# EAGLE design RobotArmController (EAGLE 7.3.0)
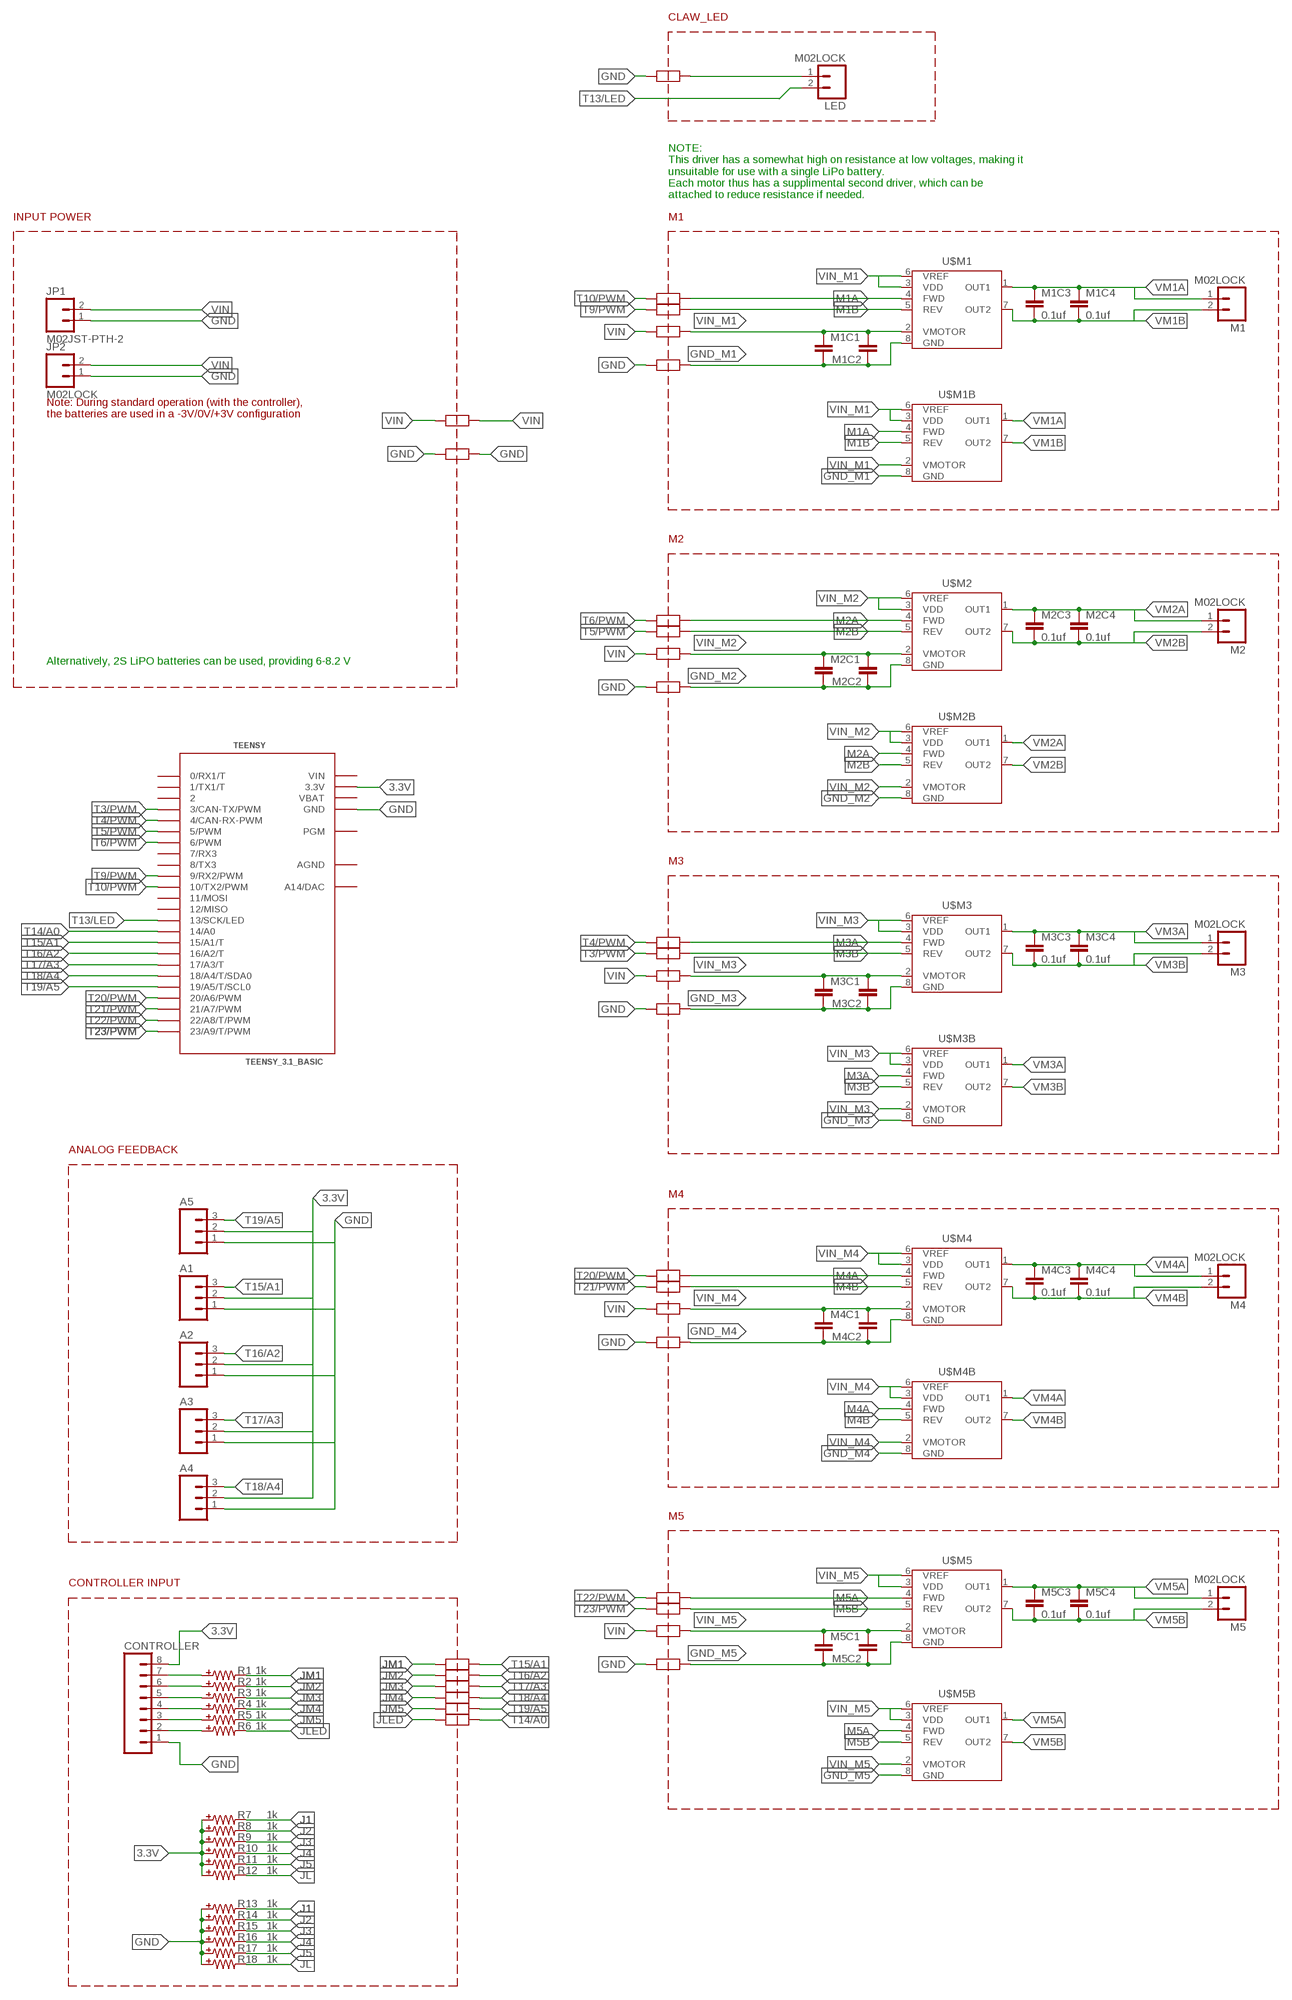
[diagram p0: schematic, sheet 1]

## Parts
A1  M03LOCK  [1X03_LOCK]
A2  M03LOCK  [1X03_LOCK]
A3  M03LOCK  [1X03_LOCK]
A4  M03LOCK  [1X03_LOCK]
A5  M03LOCK  [1X03_LOCK]
CONTROLLER  M08LOCK  [1X08_LOCK]
JP1  M02JST-PTH-2  [JST-2-PTH]
JP2  M02LOCK  [1X02_LOCK]
LED  M02LOCK  [1X02_LOCK]
M1  M02LOCK  [1X02_LOCK]
M1C1  CAP1210  [1210]
M1C2  CAPUNIVERSAL  [0402-0603-0805-UNIVERSAL]
M1C3  0.1uf  CAPUNIVERSAL  [0402-0603-0805-UNIVERSAL]
M1C4  0.1uf  CAPUNIVERSAL  [0402-0603-0805-UNIVERSAL]
M2  M02LOCK  [1X02_LOCK]
M2C1  CAP1210  [1210]
M2C2  CAPUNIVERSAL  [0402-0603-0805-UNIVERSAL]
M2C3  0.1uf  CAPUNIVERSAL  [0402-0603-0805-UNIVERSAL]
M2C4  0.1uf  CAPUNIVERSAL  [0402-0603-0805-UNIVERSAL]
M3  M02LOCK  [1X02_LOCK]
M3C1  CAP1210  [1210]
M3C2  CAPUNIVERSAL  [0402-0603-0805-UNIVERSAL]
M3C3  0.1uf  CAPUNIVERSAL  [0402-0603-0805-UNIVERSAL]
M3C4  0.1uf  CAPUNIVERSAL  [0402-0603-0805-UNIVERSAL]
M4  M02LOCK  [1X02_LOCK]
M4C1  CAP1210  [1210]
M4C2  CAPUNIVERSAL  [0402-0603-0805-UNIVERSAL]
M4C3  0.1uf  CAPUNIVERSAL  [0402-0603-0805-UNIVERSAL]
M4C4  0.1uf  CAPUNIVERSAL  [0402-0603-0805-UNIVERSAL]
M5  M02LOCK  [1X02_LOCK]
M5C1  CAP1210  [1210]
M5C2  CAPUNIVERSAL  [0402-0603-0805-UNIVERSAL]
M5C3  0.1uf  CAPUNIVERSAL  [0402-0603-0805-UNIVERSAL]
M5C4  0.1uf  CAPUNIVERSAL  [0402-0603-0805-UNIVERSAL]
R1  1k  RESISTORUNIVERSAL  [0402-0603-0805-UNIVERSAL]
R2  1k  RESISTORUNIVERSAL  [0402-0603-0805-UNIVERSAL]
R3  1k  RESISTORUNIVERSAL  [0402-0603-0805-UNIVERSAL]
R4  1k  RESISTORUNIVERSAL  [0402-0603-0805-UNIVERSAL]
R5  1k  RESISTORUNIVERSAL  [0402-0603-0805-UNIVERSAL]
R6  1k  RESISTORUNIVERSAL  [0402-0603-0805-UNIVERSAL]
R7  1k  RESISTORUNIVERSAL  [0402-0603-0805-UNIVERSAL]
R8  1k  RESISTORUNIVERSAL  [0402-0603-0805-UNIVERSAL]
R9  1k  RESISTORUNIVERSAL  [0402-0603-0805-UNIVERSAL]
R10  1k  RESISTORUNIVERSAL  [0402-0603-0805-UNIVERSAL]
R11  1k  RESISTORUNIVERSAL  [0402-0603-0805-UNIVERSAL]
R12  1k  RESISTORUNIVERSAL  [0402-0603-0805-UNIVERSAL]
R13  1k  RESISTORUNIVERSAL  [0402-0603-0805-UNIVERSAL]
R14  1k  RESISTORUNIVERSAL  [0402-0603-0805-UNIVERSAL]
R15  1k  RESISTORUNIVERSAL  [0402-0603-0805-UNIVERSAL]
R16  1k  RESISTORUNIVERSAL  [0402-0603-0805-UNIVERSAL]
R17  1k  RESISTORUNIVERSAL  [0402-0603-0805-UNIVERSAL]
R18  1k  RESISTORUNIVERSAL  [0402-0603-0805-UNIVERSAL]
TEENSY  TEENSY_3.1_BASIC  [TEENSY_3.1_BASIC]
U$1  NET-JUNCTION-2  [NET-JUNCTION-2]
U$2  NET-JUNCTION-2  [NET-JUNCTION-2]
U$3  NET-JUNCTION-2  [NET-JUNCTION-2]
U$4  NET-JUNCTION-2  [NET-JUNCTION-2]
U$5  NET-JUNCTION-2  [NET-JUNCTION-2]
U$6  NET-JUNCTION-2  [NET-JUNCTION-2]
U$7  NET-JUNCTION-2  [NET-JUNCTION-2]
U$8  NET-JUNCTION-2  [NET-JUNCTION-2]
U$9  NET-JUNCTION-2  [NET-JUNCTION-2]
U$10  NET-JUNCTION-2  [NET-JUNCTION-2]
U$11  NET-JUNCTION-2  [NET-JUNCTION-2]
U$12  NET-JUNCTION-2  [NET-JUNCTION-2]
U$13  NET-JUNCTION-2  [NET-JUNCTION-2]
U$14  NET-JUNCTION-2  [NET-JUNCTION-2]
U$15  NET-JUNCTION-2  [NET-JUNCTION-2]
U$16  NET-JUNCTION-2  [NET-JUNCTION-2]
U$17  NET-JUNCTION-2  [NET-JUNCTION-2]
U$18  NET-JUNCTION-2  [NET-JUNCTION-2]
U$19  NET-JUNCTION-2  [NET-JUNCTION-2]
U$20  NET-JUNCTION-2  [NET-JUNCTION-2]
U$21  NET-JUNCTION-2  [NET-JUNCTION-2]
U$22  NET-JUNCTION-2  [NET-JUNCTION-2]
U$23  NET-JUNCTION-2  [NET-JUNCTION-2]
U$24  NET-JUNCTION-2  [NET-JUNCTION-2]
U$25  NET-JUNCTION-2  [NET-JUNCTION-2]
U$26  NET-JUNCTION-2  [NET-JUNCTION-2]
U$27  NET-JUNCTION-2  [NET-JUNCTION-2]
U$28  NET-JUNCTION-2  [NET-JUNCTION-2]
U$29  NET-JUNCTION-2  [NET-JUNCTION-2]
U$M1  ZXBM5210  ZXBM5210SO8  [SO08]
U$M1B  ZXBM5210  ZXBM5210SO8  [SO08]
U$M2  ZXBM5210  ZXBM5210SO8  [SO08]
U$M2B  ZXBM5210  ZXBM5210SO8  [SO08]
U$M3  ZXBM5210  ZXBM5210SO8  [SO08]
U$M3B  ZXBM5210  ZXBM5210SO8  [SO08]
U$M4  ZXBM5210  ZXBM5210SO8  [SO08]
U$M4B  ZXBM5210  ZXBM5210SO8  [SO08]
U$M5  ZXBM5210  ZXBM5210SO8  [SO08]
U$M5B  ZXBM5210  ZXBM5210SO8  [SO08]

## Nets
3.3V: A1.2 A2.2 A3.2 A4.2 A5.2 CONTROLLER.8 R7.+ R8.+ R9.+ R10.+ R11.+ R12.+ TEENSY.3.3V TEENSY.3.3V1(3.3V)
GND [power]: A1.1 A2.1 A3.1 A4.1 A5.1 CONTROLLER.1 JP1.1 JP2.1 LED.1 R13.+ R14.+ R15.+ R16.+ R17.+ R18.+ TEENSY.GND TEENSY.GND1(GND) U$2.P$1 U$5.P$1 U$7.P$1 U$9.P$1 U$11.P$1 U$13.P$1 U$13.P$2 U$24.P$1 U$24.P$2
GND_M1 [power]: M1C1.2 M1C2.- U$2.P$2 U$M1.8(GND) U$M1B.8(GND)
GND_M2 [power]: M2C1.2 M2C2.- U$5.P$2 U$M2.8(GND) U$M2B.8(GND)
GND_M3 [power]: M3C1.2 M3C2.- U$7.P$2 U$M3.8(GND) U$M3B.8(GND)
GND_M4 [power]: M4C1.2 M4C2.- U$9.P$2 U$M4.8(GND) U$M4B.8(GND)
GND_M5 [power]: M5C1.2 M5C2.- U$11.P$2 U$M5.8(GND) U$M5B.8(GND)
J1: CONTROLLER.7 R1.+ R7.- R13.-
J2: CONTROLLER.6 R2.+ R8.- R14.-
J3: CONTROLLER.5 R3.+ R9.- R15.-
J4: CONTROLLER.4 R4.+ R10.- R16.-
J5: CONTROLLER.3 R5.+ R11.- R17.-
JL: CONTROLLER.2 R6.+ R12.- R18.-
JLED: R6.- U$29.P$1
JM1: R1.- U$12.P$1
JM2: R2.- U$25.P$1
JM3: R3.- U$26.P$1
JM4: R4.- U$27.P$1
JM5: R5.- U$28.P$1
M1A: U$14.P$2 U$M1.4(FWD) U$M1B.4(FWD)
M1B: U$15.P$2 U$M1.5(REV) U$M1B.5(REV)
M2A: U$16.P$2 U$M2.4(FWD) U$M2B.4(FWD)
M2B: U$17.P$2 U$M2.5(REV) U$M2B.5(REV)
M3A: U$18.P$2 U$M3.4(FWD) U$M3B.4(FWD)
M3B: U$19.P$2 U$M3.5(REV) U$M3B.5(REV)
M4A: U$20.P$2 U$M4.4(FWD) U$M4B.4(FWD)
M4B: U$21.P$2 U$M4.5(REV) U$M4B.5(REV)
M5A: U$22.P$2 U$M5.4(FWD) U$M5B.4(FWD)
M5B: U$23.P$2 U$M5.5(REV) U$M5B.5(REV)
T3/PWM [power]: TEENSY.3(3/CAN-TX/PWM) U$19.P$1
T4/PWM [power]: TEENSY.4(4/CAN-RX-PWM) U$18.P$1
T5/PWM [power]: TEENSY.5(5/PWM) U$17.P$1
T6/PWM [power]: TEENSY.6(6/PWM) U$16.P$1
T9/PWM [power]: TEENSY.9(9/RX2/PWM) U$15.P$1
T10/PWM [power]: TEENSY.10(10/TX2/PWM) U$14.P$1
T13/LED [power]: LED.2 TEENSY.13(13/SCK/LED)
T14/A0 [power]: TEENSY.14/A0 U$29.P$2
T15/A1 [power]: A1.3 TEENSY.15/A1(15/A1/T) U$12.P$2
T16/A2 [power]: A2.3 TEENSY.16/A2(16/A2/T) U$25.P$2
T17/A3 [power]: A3.3 TEENSY.17/A3(17/A3/T) U$26.P$2
T18/A4 [power]: A4.3 TEENSY.18/A4(18/A4/T/SDA0) U$27.P$2
T19/A5 [power]: A5.3 TEENSY.19/A5(19/A5/T/SCL0) U$28.P$2
T20/PWM [power]: TEENSY.20/A6(20/A6/PWM) U$20.P$1
T21/PWM [power]: TEENSY.21/A7(21/A7/PWM) U$21.P$1
T22/PWM [power]: TEENSY.22/A8(22/A8/T/PWM) U$22.P$1
T23/PWM [power]: TEENSY.23/A9(23/A9/T/PWM) U$23.P$1
VIN [power]: JP1.2 JP2.2 U$1.P$1 U$3.P$1 U$4.P$1 U$4.P$2 U$6.P$1 U$8.P$1 U$10.P$1
VIN_M1 [power]: M1C1.1 M1C2.+ U$1.P$2 U$M1.2(VMOTOR) U$M1.3(VDD) U$M1.6(VREF) U$M1B.2(VMOTOR) U$M1B.3(VDD) U$M1B.6(VREF)
VIN_M2 [power]: M2C1.1 M2C2.+ U$3.P$2 U$M2.2(VMOTOR) U$M2.3(VDD) U$M2.6(VREF) U$M2B.2(VMOTOR) U$M2B.3(VDD) U$M2B.6(VREF)
VIN_M3 [power]: M3C1.1 M3C2.+ U$6.P$2 U$M3.2(VMOTOR) U$M3.3(VDD) U$M3.6(VREF) U$M3B.2(VMOTOR) U$M3B.3(VDD) U$M3B.6(VREF)
VIN_M4 [power]: M4C1.1 M4C2.+ U$8.P$2 U$M4.2(VMOTOR) U$M4.3(VDD) U$M4.6(VREF) U$M4B.2(VMOTOR) U$M4B.3(VDD) U$M4B.6(VREF)
VIN_M5 [power]: M5C1.1 M5C2.+ U$10.P$2 U$M5.2(VMOTOR) U$M5.3(VDD) U$M5.6(VREF) U$M5B.2(VMOTOR) U$M5B.3(VDD) U$M5B.6(VREF)
VM1A [power]: M1.1 M1C3.- M1C4.- U$M1.1(OUT1) U$M1B.1(OUT1)
VM1B [power]: M1.2 M1C3.+ M1C4.+ U$M1.7(OUT2) U$M1B.7(OUT2)
VM2A [power]: M2.1 M2C3.- M2C4.- U$M2.1(OUT1) U$M2B.1(OUT1)
VM2B [power]: M2.2 M2C3.+ M2C4.+ U$M2.7(OUT2) U$M2B.7(OUT2)
VM3A [power]: M3.1 M3C3.- M3C4.- U$M3.1(OUT1) U$M3B.1(OUT1)
VM3B [power]: M3.2 M3C3.+ M3C4.+ U$M3.7(OUT2) U$M3B.7(OUT2)
VM4A [power]: M4.1 M4C3.- M4C4.- U$M4.1(OUT1) U$M4B.1(OUT1)
VM4B [power]: M4.2 M4C3.+ M4C4.+ U$M4.7(OUT2) U$M4B.7(OUT2)
VM5A [power]: M5.1 M5C3.- M5C4.- U$M5.1(OUT1) U$M5B.1(OUT1)
VM5B [power]: M5.2 M5C3.+ M5C4.+ U$M5.7(OUT2) U$M5B.7(OUT2)
Unconnected: TEENSY.0(0/RX1/T) TEENSY.1(1/TX1/T) TEENSY.2 TEENSY.7(7/RX3) TEENSY.8(8/TX3) TEENSY.11(11/MOSI) TEENSY.12(12/MISO) TEENSY.A14(A14/DAC) TEENSY.PGM

## Notes on the sheet
- CLAW_LED
- NOTE:
  This driver has a somewhat high on resistance at low voltages, making it 
  unsuitable for use with a single LiPo battery. 
  Each motor thus has a supplimental second driver, which can be 
  attached to reduce resistance if needed.
- INPUT POWER | M1
- Note: During standard operation (with the controller),
  the batteries are used in a -3V/0V/+3V configuration
- M2
- Alternatively, 2S LiPO batteries can be used, providing 6-8.2 V
- M3
- ANALOG FEEDBACK
- M4
- M5
- CONTROLLER INPUT

## Power pins joined to a net without a drawn wire
AGND: TEENSY.AGND
VBAT: TEENSY.VBAT
VIN: TEENSY.VIN

## Library data of the parts
A1-A5 = tekdemo:M03: Header 3 Standard 3-pin 0.1" header. Use with straight break away headers (SKU : PRT-00116), right angle break away headers (PRT-00553), swiss pins (PRT-00743), machine pins (PRT-00117), and female headers (PRT-00115). Molex polarized connector foot print use with SKU : PRT-08232 with associated crimp pins and housings.
CONTROLLER = SparkFun-Connectors:M08: Header 8 Standard 8-pin 0.1" header. Use with straight break away headers (SKU : PRT-00116), right angle break away headers (PRT-00553), swiss pins (PRT-00743), machine pins (PRT-00117), and female headers (PRT-00115).
JP1 = tekdemo:M02: Standard 2-pin 0.1" header. Use with - straight break away headers ( PRT-00116) - right angle break away headers (PRT-00553) - swiss pins (PRT-00743) - machine pins (PRT-00117) - female headers (PRT-00115) Molex polarized connector foot print use with: PRT-08233 with associated crimp pins and housings. 2.54_SCREWTERM for use with PRT-10571. 3.5mm Screw Terminal footprints for PRT-08084 5mm Screw Terminal footprints for use with PRT-08432; SKU: PRT-09914
JP2 LED M1-M5 = tekdemo:M02: Standard 2-pin 0.1" header. Use with - straight break away headers ( PRT-00116) - right angle break away headers (PRT-00553) - swiss pins (PRT-00743) - machine pins (PRT-00117) - female headers (PRT-00115) Molex polarized connector foot print use with: PRT-08233 with associated crimp pins and housings. 2.54_SCREWTERM for use with PRT-10571. 3.5mm Screw Terminal footprints for PRT-08084 5mm Screw Terminal footprints for use with PRT-08432
M1C1-M1C4 M2C1-M2C4 M3C1-M3C4 M4C1-M4C4 M5C1-M5C4 = tekdemo:CAP: Capacitor Standard 0603 ceramic capacitor, and 0.1" leaded capacitor.
R1-R18 = tekdemo:RESISTOR: Resistor Basic schematic elements and footprints for 0603, 1206, and PTH resistors.
TEENSY = Teensy_3_Series_Board_v1.0:TEENSY_3.1_BASIC: Footprint for Teensy 3.1 board using all pin connections on the outer perimeter
U$1-U$29 = tekdemo:NET-JUNCTION-2
U$M1 U$M1B U$M2 U$M2B U$M3 U$M3B U$M4 U$M4B U$M5 U$M5B = tekdemo:ZXBM5210: PWM Motor Driver http://www.diodes.com/datasheets/ZXBM5210.pdf

## Net classes
1 power: width 0.508 mm, drill 0.508 mm, clearance 0.254 mm to class 0, clearance 0.254 mm

## Board
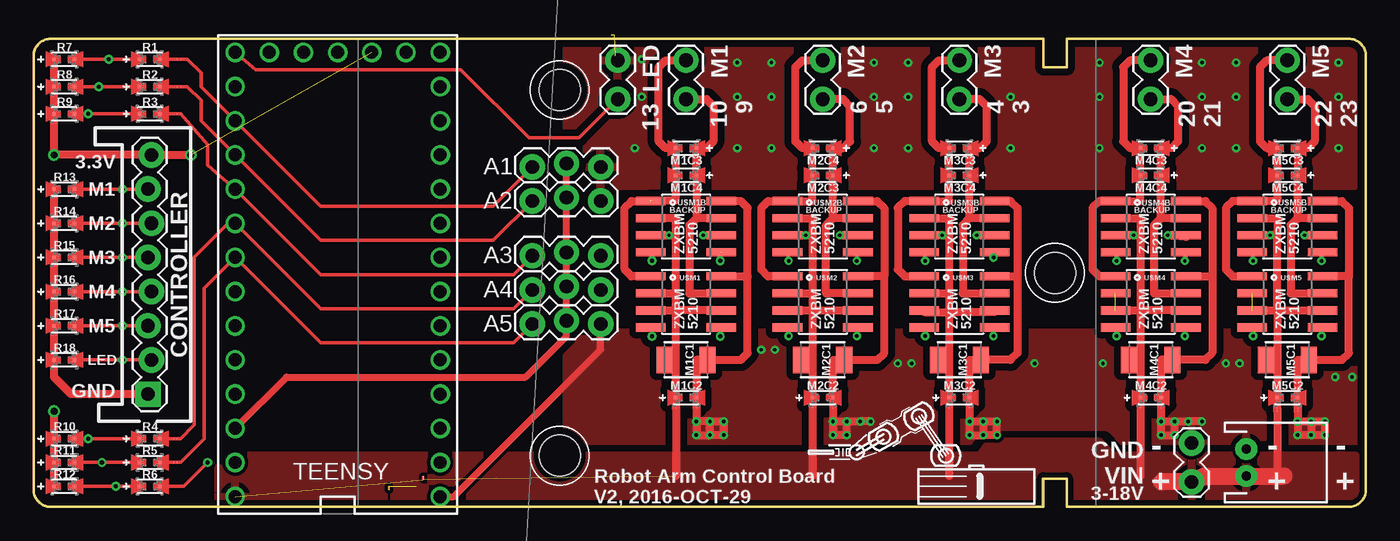
[diagram p1: board, top side]
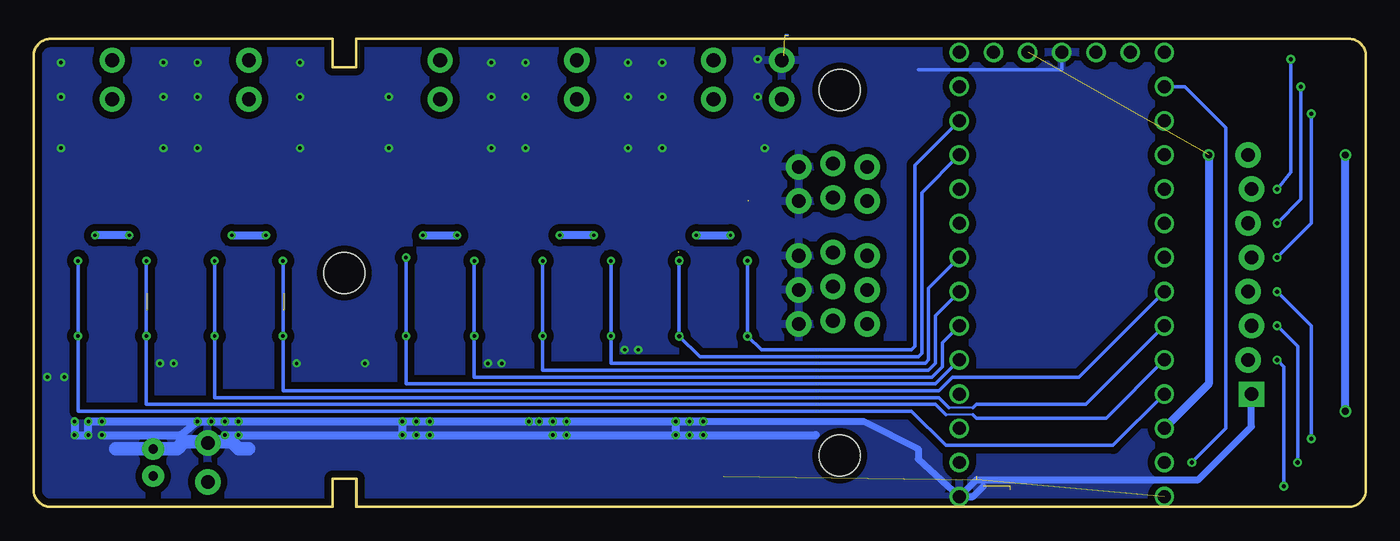
[diagram p2: board, bottom side, seen from below]

Size 99.06 x 34.8 mm. Coordinates in mm from the lower left corner, seen from the top.
Outline: 75.06,0 75.06,2.11
Outline: 75.08,0 1.27,0 arc-90 0,1.27 0,33.53 arc-90 1.27,34.8 75.08,34.8 75.08,32.69 76.81,32.69 76.81,34.8 97.79,34.8 arc-90 99.06,33.53 99.06,1.27 arc-90 97.79,0 76.81,0 76.81,2.11 75.08,2.11 75.08,0
Copper layers (1*16): Top 0.0356mm / dielectric 1.5011mm / Bottom 0.0356mm
Design rules "LaenPCBOrder-tented *": minimum track width 6mil, minimum drill 10mil, track to track 6mil, track to pad 6mil, pad to pad 6mil, via to via 6mil, smd to smd 0mil, copper to edge 15mil, drill to drill 6mil, minimum pad ring 7mil, minimum via ring 7mil, stop-mask expansion 4mil, vias tented up to drill 25mil, thermal gap 15mil
Holes 3.05 mm at 75.95,17.4 39.12,30.99 39.12,3.81

### Footprints (pad centres in the part's own frame; a part is rotated, then mirrored left to right if it is on the bottom)
1X03_LOCK = drill 1.016 pad 1.88: 1 0,0.127; 2 2.54,-0.127; 3 5.08,0.127
1X08_LOCK = drill 1.016 pad 1.88 square: 1 0,0.127 | drill 1.016 pad 1.88: 2 2.54,-0.127; 3 5.08,0.127; 4 7.62,-0.127; 5 10.16,0.127; 6 12.7,-0.127; 7 15.24,0.127; 8 17.78,-0.127
JST-2-PTH = drill 0.7 pad 1.6: 1 -1,0; 2 1,0
1X02_LOCK = drill 1.016 pad 1.88: 1 -0.178,0; 2 2.718,0
1210 = smd 1.2 x 2: 1 -1.6,0; 2 1.6,0
0402-0603-0805-UNIVERSAL = smd 0.254 x 0.254: + -0.762,0; - 0.762,0
TEENSY_3.1_BASIC = drill 0.965: 0 -7.62,13.97; 1 -7.62,11.43; 2 -7.62,8.89; 3 -7.62,6.35; 3.3V 7.62,11.43; 3.3V1 -2.54,-16.51; 4 -7.62,3.81; 5 -7.62,1.27; 6 -7.62,-1.27; 7 -7.62,-3.81; 8 -7.62,-6.35; 9 -7.62,-8.89; 10 -7.62,-11.43; 11 -7.62,-13.97; 12 -7.62,-16.51; 13 7.62,-16.51; 14/A0 7.62,-13.97; 15/A1 7.62,-11.43; 16/A2 7.62,-8.89; 17/A3 7.62,-6.35; 18/A4 7.62,-3.81; 19/A5 7.62,-1.27; 20/A6 7.62,1.27; 21/A7 7.62,3.81; 22/A8 7.62,6.35; 23/A9 7.62,8.89; A14 5.08,-16.51; AGND 7.62,13.97; GND -7.62,16.51; GND1 0,-16.51; PGM 2.54,-16.51; VBAT -5.08,-16.51; VIN 7.62,16.51
NET-JUNCTION-2 = smd 0.127 x 0.127: P$1 0,0; P$2 0.254,0
SO08 = smd 0.61 x 2.21: 1 -1.905,-2.616; 2 -0.635,-2.616; 3 0.635,-2.616; 4 1.905,-2.616; 5 1.905,2.616; 6 0.635,2.616; 7 -0.635,2.616; 8 -1.905,2.616

### Placement (x,y rotation side)
A1  42.16,25.4 180 top
A2  42.16,22.86 180 top
A3  42.16,18.8 180 top
A4  42.16,16.26 180 top
A5  42.16,13.72 180 top
CONTROLLER  8.64,8.38 90 top
JP1  90.17,3.3 270 top
JP2  86.11,4.57 270 top
LED  43.43,33.02 270 top
M1  48.51,33.02 270 top
M1C1  48.51,10.92 0 top
M1C2  48.51,8.13 0 top
M1C3  48.51,26.67 180 top
M1C4  48.51,24.64 180 top
M2  58.67,33.02 270 top
M2C1  58.67,10.92 0 top
M2C2  58.67,8.13 0 top
M2C3  58.67,24.64 180 top
M2C4  58.67,26.67 180 top
M3  68.83,33.02 270 top
M3C1  68.83,10.92 0 top
M3C2  68.83,8.13 0 top
M3C3  68.83,26.67 180 top
M3C4  68.83,24.64 180 top
M4  83.06,33.02 270 top
M4C1  83.06,10.92 0 top
M4C2  83.06,8.13 0 top
M4C3  83.06,26.67 180 top
M4C4  83.06,24.64 180 top
M5  93.22,33.02 270 top
M5C1  93.22,10.92 0 top
M5C2  93.22,8.13 0 top
M5C3  93.22,26.67 180 top
M5C4  93.22,24.64 180 top
R1  8.64,33.27 0 top
R2  8.64,31.24 0 top
R3  8.64,29.21 0 top
R4  8.64,5.08 0 top
R5  8.64,3.3 0 top
R6  8.64,1.52 0 top
R7  2.29,33.27 0 top
R8  2.29,31.24 0 top
R9  2.29,29.21 0 top
R10  2.29,5.08 0 top
R11  2.29,3.3 0 top
R12  2.29,1.52 0 top
R13  2.29,23.62 0 top
R14  2.29,21.08 0 top
R15  2.29,18.54 0 top
R16  2.29,16 0 top
R17  2.29,13.46 0 top
R18  2.29,10.92 0 top
TEENSY  22.61,17.27 180 top
U$1  47.75,7.62 270 top
U$2  49.28,7.62 270 top
U$3  57.91,7.62 270 top
U$4  28.96,2.29 270 top
U$5  59.44,7.62 270 top
U$6  68.07,7.62 270 top
U$7  69.6,7.62 270 top
U$8  82.3,7.62 270 top
U$9  83.82,7.62 270 top
U$10  92.46,7.37 270 top
U$11  93.98,7.37 270 top
U$12  10.92,33.27 180 top
U$13  42.93,35.05 180 bottom
U$14  40.89,11.68 0 bottom
U$15  40.89,11.18 0 bottom
U$16  40.89,10.67 0 bottom
U$17  40.89,10.16 0 bottom
U$18  40.89,9.65 0 bottom
U$19  40.89,9.14 0 bottom
U$20  40.89,8.64 0 bottom
U$21  40.89,8.13 0 bottom
U$22  40.89,7.62 0 bottom
U$23  40.89,7.11 0 bottom
U$24  26.42,1.52 270 top
U$25  10.92,31.24 180 top
U$26  10.92,29.21 180 top
U$27  10.67,5.08 180 top
U$28  10.67,3.3 180 top
U$29  14.22,31.24 0 bottom
U$M1  48.51,15.24 270 top
U$M1B  48.51,20.83 270 top
U$M2  58.67,15.24 270 top
U$M2B  58.67,20.83 270 top
U$M3  68.83,15.24 270 top
U$M3B  68.83,20.83 270 top
U$M4  83.06,15.24 270 top
U$M4B  83.06,20.83 270 top
U$M5  93.22,15.24 270 top
U$M5B  93.22,20.83 270 top

### Tracks (layer width: path | path; a pad name or v marks a point on that pad's centre or on a via)
3.3V  (via drill 0.51)  (1 unrouted)
  Top 0.508: A1.2 A2.2 A3.2 A4.2 A5.2 39.62,12.7 36.58,9.65 18.8,9.65 TEENSY.3.3V
  Top 0.61: v11.68,26.16 CONTROLLER.8 v1.52,26.16 R9.+ R8.+ R7.+ | R12.+ R11.+ R10.+ v1.52,7.11
  Bottom 0.61: v11.68,26.16 11.68,9.14 TEENSY.3.3V | v1.52,7.11 v1.52,26.16
GND  (via drill 0.25)  (4 unrouted)
  Top 0.508: TEENSY.GND 31.24,0.76 42.16,11.68 42.16,13.72
  Top 0.61: U$11.P$1 v93.98,6.35 | U$9.P$1 v83.82,6.35 | U$7.P$1 v69.6,6.35 | U$5.P$1 v59.44,6.35 | U$2.P$1 v49.28,6.35 | v93.98,6.35 v93.98,5.33 v95,5.33 | 83.82,8.13 v83.82,6.35 | v83.82,6.35 v83.82,5.33 v84.84,5.33 v84.84,6.35 | 69.6,8.13 v69.6,6.35 | v69.6,6.35 v69.6,5.33 v70.61,5.33 | 59.44,8.13 v59.44,6.35 | v59.44,6.35 v59.44,5.33 v60.45,5.33 v60.45,6.35 | 49.28,8.13 v49.28,6.35 | v49.28,6.35 v49.28,5.33 v50.29,5.33 | 93.98,7.87 v93.98,6.35 | v50.29,5.33 v51.31,5.33 v51.31,6.35 v50.29,6.35 | v50.29,5.33 v50.29,6.35 | v50.29,6.35 v49.28,6.35 | v59.44,6.35 v60.45,6.35 | v62.23,6.35 v61.47,6.35 v60.45,6.35 | v69.6,6.35 v70.61,6.35 | v70.61,6.35 v70.61,5.33 | v83.82,6.35 v84.84,6.35 | v86.87,6.35 v85.85,6.35 v84.84,6.35 | v95,5.33 v96.01,5.33 v96.01,6.35 v95,6.35 | v93.98,6.35 v95,6.35 | v95,6.35 v95,5.33 | v70.61,6.35 v71.63,6.35 v71.63,5.33 v70.61,5.33 | CONTROLLER.1 2.79,8.38 1.52,9.65 R18.+ R17.+ R16.+ R15.+ R14.+ R13.+
  Bottom 0.254: LED.1 43.26,33.53 | TEENSY.GND1 22.61,32.51 33.27,32.51
  Bottom 0.508: v49.28,6.35 37.34,6.35 33.27,4.32 33.27,3.56 TEENSY.GND | TEENSY.GND 29.21,0.76 28.45,1.52 | TEENSY.GND 28.96,2.03 12.45,2.03 8.51,5.97 CONTROLLER.1
  Bottom 0.61: v71.63,5.33 v71.63,6.35 | v62.23,6.35 v61.47,6.35 | v51.31,5.33 v51.31,6.35 | v93.98,5.33 88.14,5.33 v86.87,6.35 | v84.84,5.33 v83.82,5.33 v70.61,5.33 v69.6,5.33 v60.45,5.33 v59.44,5.33 v50.29,5.33 v49.28,5.33 40.89,5.33 | v86.87,6.35 v93.98,6.35 v95,6.35 v95,5.33 v96.01,5.33 v96.01,6.35 | v86.87,6.35 v85.85,6.35 v84.84,6.35 v83.82,6.35 v70.61,6.35 v69.6,6.35 v60.45,6.35 v59.44,6.35 v50.29,6.35 v49.28,6.35
  Bottom 1.016: 92.96,4.32 88.39,4.32 87.88,4.83 84.33,4.83 83.82,4.32 83.06,4.32
  other vias: 98.04,9.65 96.77,9.65 89.66,10.67 88.65,10.67 79.5,10.67 74.42,10.67 64.26,10.67 65.28,10.67 55.12,11.68 54.1,11.68 45.21,33.27 45.21,30.48 44.7,26.67 52.32,33.02 52.32,30.48 52.32,26.67 54.86,26.67 54.86,30.48 54.86,33.02 62.48,33.02 62.48,30.48 62.48,26.67 65.02,26.67 65.02,30.48 65.02,33.02 72.64,30.48 72.64,26.67 79.25,26.67 79.25,30.48 79.25,33.02 86.87,33.02 86.87,30.48 86.87,26.67 89.41,26.67 89.41,30.48 89.41,33.02 97.03,33.02 97.03,30.48 97.03,26.67
  pour Bottom (isolate 0.508): 14.22,0.25 14.22,34.54 98.3,35.05 98.3,0.76
  pour Top (isolate 0.508, rank 6): 39.62,12.95 39.62,4.32 98.3,4.32 98.3,12.95
  pour Top (isolate 0.508, rank 6): 39.62,34.8 39.62,23.88 98.3,23.88 98.3,34.8
GND_M1
  Top 0.61: 53.09,17.15 53.09,11.43 52.58,10.92 M1C1.2 49.28,10.92 M1C2.- U$2.P$2 | 53.09,17.15 53.09,22.23 52.58,22.73 U$M1B.8 | U$M1.8 53.09,17.15
GND_M2
  Top 0.508: M2C2.- U$5.P$2
  Top 0.61: M2C2.- 59.44,10.92 M2C1.2 62.74,10.92 63.25,11.43 63.25,17.15 | 63.25,17.15 U$M2.8 | U$M2B.8 62.74,22.73 63.25,22.23 63.25,17.15
GND_M3
  Top 0.61: U$M3B.8 72.64,22.73 73.15,22.23 73.15,17.15 | U$M3.8 73.15,17.15 | 73.15,17.15 73.15,11.43 72.64,10.92 M3C1.2 69.6,10.92 M3C2.- U$7.P$2
GND_M4
  Top 0.61: U$M4B.8 87.12,22.73 87.63,22.23 87.63,17.15 | U$M4.8 87.63,17.15 | 87.63,17.15 87.63,11.43 87.12,10.92 M4C1.2 83.82,10.92 M4C2.- U$9.P$2
GND_M5
  Top 0.61: U$M5B.8 97.28,22.73 97.79,22.23 97.79,17.15 | 97.79,17.15 U$M5.8 | 97.79,17.15 97.79,11.43 97.28,10.92 M5C1.2 93.98,10.92 M5C2.- U$11.P$2
J1  (via drill 0.3)
  Top 0.254: R1.+ v5.59,33.27 R7.- | CONTROLLER.7 v6.6,23.62 R13.-
  Bottom 0.254: v5.59,33.27 5.59,24.89 v6.6,23.62
J2  (via drill 0.3)
  Top 0.254: R2.+ v4.83,31.24 R8.- | CONTROLLER.6 v6.6,21.08 R14.-
  Bottom 0.254: v4.83,31.24 4.83,22.86 v6.6,21.08
J3  (via drill 0.3)
  Top 0.254: R3.+ v4.06,29.21 R9.- | CONTROLLER.5 v6.6,18.54 R15.-
  Bottom 0.254: v4.06,29.21 4.06,21.08 v6.6,18.54
J4  (via drill 0.3)
  Top 0.254: CONTROLLER.4 v6.6,16 R16.- | R4.+ v4.06,5.08 R10.-
  Bottom 0.254: v6.6,16 4.06,13.46 v4.06,5.08
J5  (via drill 0.3)
  Top 0.254: CONTROLLER.3 v6.6,13.46 R17.- | R5.+ v5.08,3.3 R11.-
  Bottom 0.254: v6.6,13.46 5.08,11.94 v5.08,3.3
JL  (via drill 0.3)
  Top 0.254: CONTROLLER.2 v6.6,10.92 R18.- | R6.+ v6.1,1.52 R12.-
  Bottom 0.254: v6.6,10.92 6.1,10.41 v6.1,1.52
JLED  (via drill 0.3)
  Top 0.254: v12.95,3.3 11.18,1.52 R6.-
  Bottom 0.254: U$29.P$1 13.46,31.24 10.41,28.19 10.41,5.84 v12.95,3.3
JM1
  Top 0.254: U$12.P$1 R1.-
JM2
  Top 0.254: R2.- U$25.P$1
JM3
  Top 0.254: R3.- U$26.P$1
JM4
  Top 0.254: R4.- U$27.P$1
JM5
  Top 0.254: R5.- U$28.P$1
M1A  (via drill 0.3)
  Top 0.254: U$M1B.4 45.97,18.92 v45.97,18.29 | U$M1.4 v45.97,12.7
  Bottom 0.254: v45.97,18.29 v45.97,12.7 44.96,11.68 U$14.P$2
M1B  (via drill 0.3)  (1 unrouted)
  Top 0.254: 51.05,18.92 v51.05,18.29 | U$M1.5 v51.05,12.7
  Bottom 0.254: v51.05,18.29 v51.05,12.7 49.53,11.18 U$15.P$2
M2A  (via drill 0.25)
  Top 0.254: U$M2B.4 56.13,18.92 v56.13,18.29 | U$M2.4 56.13,13.33 v56.13,12.7
  Bottom 0.254: v56.13,18.29 v56.13,12.7 56.13,10.67 U$16.P$2
M2B  (via drill 0.25)
  Top 0.254: U$M2B.5 61.21,18.92 v61.21,18.29 | v61.21,12.7 61.29,12.7 U$M2.5
  Bottom 0.254: v61.21,18.29 v61.21,12.7 61.21,10.16 U$17.P$2
M3A  (via drill 0.25)
  Top 0.254: U$M3B.4 66.22,18.29 v66.29,18.29 | v66.29,12.7 66.29,13.33 U$M3.4
  Bottom 0.254: v66.29,18.29 v66.29,12.7 66.29,9.65 U$18.P$2
M3B  (via drill 0.25)
  Top 0.254: U$M3B.5 71.45,18.54 v71.37,18.54 | v71.37,12.7 71.37,13.33 U$M3.5
  Bottom 0.254: v71.37,18.54 v71.37,12.7 71.37,9.14 U$19.P$2
M4A  (via drill 0.25)
  Top 0.254: U$M4B.4 80.52,18.92 v80.52,18.29 | v80.52,12.7 80.52,13.33 U$M4.4
  Bottom 0.254: v80.52,18.29 v80.52,12.7 80.52,8.64 U$20.P$2
M4B  (via drill 0.25)
  Top 0.254: U$M4B.5 85.67,18.29 v85.6,18.29 | v85.6,12.7 85.6,13.33 U$M4.5
  Bottom 0.254: v85.6,18.29 v85.6,12.7 85.6,8.13 U$21.P$2
M5A  (via drill 0.25)
  Top 0.254: U$M5B.4 90.6,18.29 v90.68,18.29 | v90.68,12.7 90.68,13.33 U$M5.4
  Bottom 0.254: v90.68,18.29 v90.68,12.7 90.68,7.62 U$22.P$2
M5B  (via drill 0.25)
  Top 0.254: U$M5B.5 95.76,18.92 v95.76,18.29 | v95.76,12.7 95.76,13.33 U$M5.5
  Bottom 0.254: v95.76,18.29 v95.76,12.7 95.76,7.11 U$23.P$2
T3/PWM
  Bottom 0.254: TEENSY.3 32,9.14 U$19.P$1
T4/PWM
  Bottom 0.254: U$18.P$1 32.26,9.65 31.5,10.41 31.5,12.19 TEENSY.4
T5/PWM
  Bottom 0.254: TEENSY.5 32,14.22 32,10.67 32.51,10.16 U$17.P$1
T6/PWM
  Bottom 0.254: TEENSY.6 32.51,16.26 32.51,10.92 32.77,10.67 U$16.P$1
T9/PWM
  Bottom 0.254: TEENSY.9 33.02,23.37 33.02,11.43 33.27,11.18 U$15.P$1
T10/PWM
  Bottom 0.254: TEENSY.10 33.53,25.4 33.53,11.94 33.78,11.68 U$14.P$1
T13/LED
  Top 0.254: TEENSY.13 16.51,32.51 31.75,32.51 36.83,27.43 40.56,27.43 LED.2
T14/A0
  Bottom 0.254: TEENSY.14/A0 U$29.P$2
T15/A1
  Top 0.254: A1.3 34.16,22.35 21.34,22.35 TEENSY.15/A1 12.45,31.24 12.45,32.26 11.43,33.27 U$12.P$2
T16/A2
  Top 0.254: A2.3 34.16,19.81 21.34,19.81 TEENSY.16/A2 12.45,28.7 12.45,30.23 11.43,31.24 U$25.P$2
T17/A3
  Top 0.254: A3.3 35.69,17.27 21.34,17.27 TEENSY.17/A3 12.95,25.4 12.95,26.92 10.92,29.21 U$26.P$2
T18/A4
  Top 0.254: A4.3 35.69,14.73 21.34,14.73 TEENSY.18/A4 14.48,21.08 11.94,18.54 11.94,6.1 10.92,5.08 U$27.P$2
T19/A5
  Top 0.254: A5.3 35.69,12.19 21.34,12.19 TEENSY.19/A5 12.7,16.26 12.7,5.08 10.92,3.3 U$28.P$2
T20/PWM
  Bottom 0.254: TEENSY.20/A6 21.34,9.65 30.73,9.65 31.75,8.64 U$20.P$1
T21/PWM
  Bottom 0.152: 29.21,7.37 30.99,7.37
  Bottom 0.254: TEENSY.21/A7 20.83,7.62 28.96,7.62 29.21,7.37 | 30.99,7.37 31.75,8.13 U$21.P$1
T22/PWM
  Bottom 0.152: 29.21,6.86 31.24,6.86
  Bottom 0.254: TEENSY.22/A8 19.3,6.6 28.96,6.6 29.21,6.86 | 31.24,6.86 32,7.62 U$22.P$1
T23/PWM
  Bottom 0.254: TEENSY.23/A9 18.8,4.57 31.24,4.57 33.78,7.11 U$23.P$1
VIN  (3 unrouted)
  Top 0.61: U$1.P$1 47.75,2.29 | U$3.P$1 57.91,2.29 | U$6.P$1 68.07,2.29 | U$8.P$1 82.3,2.29 | U$10.P$1 92.46,2.29
  Top 1.27: 92.96,2.29 87.05,2.29 JP2.2 83.87,1.85
  pour Top (isolate 0.254): 13.72,3.81 13.72,0 98.3,0 98.3,3.81 80.26,3.81 79.25,4.83 71.12,4.83 70.36,3.81
VIN_M1  (via drill 0.25)
  Top 0.254: U$M1B.6 v49.78,20.19
  Top 0.61: 47.75,14.6 47.75,15.87 | 47.75,15.87 47.75,20.19 | 47.75,20.19 47.75,21.46 U$M1B.2 | U$M1.3 47.75,14.6 | U$M1.2 47.75,15.87 | U$M1B.3 v47.24,20.19 47.75,20.19 | U$M1.6 47.75,14.6 | M1C1.1 47.75,10.92 | 47.75,10.92 47.75,14.6 | 47.75,10.92 M1C2.+ U$1.P$2
  Bottom 0.61: v49.78,20.19 v47.24,20.19
VIN_M2  (via drill 0.25)
  Top 0.61: M2C1.1 57.91,10.92 | 57.91,10.92 M2C2.+ U$3.P$2 | U$M2.3 57.91,14.6 | 57.91,14.6 57.91,10.92 | 57.91,14.6 U$M2.6 | U$M2.2 57.91,15.87 | 57.91,15.87 57.91,14.6 | U$M2B.2 57.91,21.46 57.91,20.19 | 57.91,20.19 57.91,15.87 | v57.4,20.19 U$M2B.3 57.91,20.19 | v59.94,20.19 U$M2B.6
  Bottom 0.61: v57.4,20.19 v59.94,20.19
VIN_M3  (via drill 0.25)
  Top 0.61: U$M3.2 68.07,15.87 | 68.07,15.87 68.07,14.48 | 68.07,14.48 68.07,10.92 | 68.07,10.92 M3C1.1 | 68.07,10.92 M3C2.+ U$6.P$2 | U$M3.6 71.45,14.48 68.07,14.48 | U$M3.3 66.22,14.48 68.07,14.48 | U$M3B.2 68.07,21.46 68.07,20.19 | 68.07,20.19 68.07,15.87 | U$M3B.6 v70.1,20.19 | U$M3B.3 v67.56,20.19 68.07,20.19
  Bottom 0.61: v70.1,20.19 v67.56,20.19
VIN_M4  (via drill 0.25)  (1 unrouted)
  Top 0.61: 82.3,20.19 82.3,14.6 | 82.3,14.6 82.3,10.92 | 82.3,10.92 M4C1.1 | 82.3,10.92 M4C2.+ U$8.P$2 | U$M4.3 82.3,14.6 | U$M4.6 82.3,14.6 | U$M4B.6 85.67,20.07 v84.33,20.19 | U$M4B.3 v81.79,20.19 82.3,20.19 | U$M4B.2 82.3,21.46 82.3,20.19
  Bottom 0.61: v84.33,20.19 v81.79,20.19
VIN_M5  (via drill 0.25)  (1 unrouted)
  Top 0.61: U$M5B.3 v91.95,20.19 92.46,20.19 | v94.49,20.19 U$M5B.6 | U$M5B.2 92.46,21.46 92.46,20.19 | U$M5.3 92.46,14.6 | 92.46,14.6 92.46,20.19 | 92.46,14.6 U$M5.6 | 92.46,14.6 92.46,10.92 | 92.46,10.92 M5C2.+ U$10.P$2 | M5C1.1 92.46,10.92
  Bottom 0.61: v91.95,20.19 v94.49,20.19
VM1A  (1 unrouted)
  Top 0.61: U$M1.1 44.45,17.15 43.94,17.65 43.94,22.23 44.45,22.73 U$M1B.1 | 45.9,22.78 47.75,22.78 M1C4.- M1C3.- 46.99,26.67 46.48,27.18 46.48,32.69 46.99,33.2 M1.1
VM1B
  Top 0.61: 49.28,21.46 M1C4.+ M1C3.+ 50.04,26.67 50.55,27.18 50.55,29.79 50.04,30.3 M1.2 | 49.28,21.46 48.77,20.95 48.77,15.87 U$M1.7 | U$M1B.7 49.28,21.46
VM2A
  Top 0.61: U$M2.1 54.61,17.15 54.1,17.65 54.1,22.23 54.61,22.73 U$M2B.1 57.91,22.73 M2C3.- M2C4.- 57.15,26.67 56.64,27.18 56.64,32.69 57.15,33.2 M2.1
VM2B
  Top 0.61: U$M2.7 58.93,15.87 58.93,20.95 59.44,21.46 | 59.44,21.46 M2C3.+ M2C4.+ 60.2,26.67 60.71,27.18 60.71,29.79 60.2,30.3 M2.2 | U$M2B.7 59.44,21.46
VM3A
  Top 0.61: U$M3.1 64.77,17.15 64.26,17.65 64.26,22.23 64.77,22.73 U$M3B.1 68.07,22.73 M3C4.- M3C3.- 67.31,26.67 66.8,27.18 66.8,32.69 67.31,33.2 M3.1
VM3B
  Top 0.61: U$M3B.7 69.6,21.46 | U$M3.7 69.09,15.87 69.09,20.95 69.6,21.46 | 69.6,21.46 M3C4.+ M3C3.+ 70.36,26.67 70.87,27.18 70.87,29.79 70.36,30.3 M3.2
VM4A
  Top 0.61: U$M4.1 79.25,17.15 78.74,17.65 78.74,22.23 79.25,22.73 U$M4B.1 82.3,22.73 M4C4.- M4C3.- 81.53,26.67 81.03,27.18 81.03,32.69 81.53,33.2 M4.1
VM4B
  Top 0.61: 83.82,21.46 M4C4.+ M4C3.+ 84.58,26.67 85.09,27.18 85.09,29.79 84.58,30.3 M4.2 | U$M4B.7 83.82,21.46 | 83.82,21.46 83.31,20.95 83.31,15.87 U$M4.7
VM5A
  Top 0.61: M5.1 91.69,33.2 91.19,32.69 91.19,27.18 91.69,26.67 M5C3.- M5C4.- 92.46,22.73 U$M5B.1 89.15,22.73 88.65,22.23 88.65,17.65 89.15,17.15 U$M5.1
VM5B
  Top 0.61: 93.98,21.46 M5C4.+ M5C3.+ 94.74,26.67 95.25,27.18 95.25,29.79 94.74,30.3 M5.2 | U$M5B.7 93.98,21.46 | 93.98,21.46 93.47,20.95 93.47,15.87 U$M5.7

### Text on the board
tPlace: 3.3V | M1 | M2 | M3 | M4 | M5 | LED | GND | GND / VIN | - / + | - / + | - / + | 3-18V | Robot Arm Control Board / V2, 2016-OCT-29
tNames: 13 | 10 / 9 | 6 / 5 | 4 / 3 | 20 / 21 | 22 / 23 | BACKUP | BACKUP | BACKUP | BACKUP | BACKUP | ZXBM / 5210 | ZXBM / 5210 | ZXBM / 5210 | ZXBM / 5210 | ZXBM / 5210 | ZXBM / 5210 | ZXBM / 5210 | ZXBM / 5210 | ZXBM / 5210 | ZXBM / 5210